# EAGLE design brushless_motorshield_v1 (EAGLE 6.5.0)
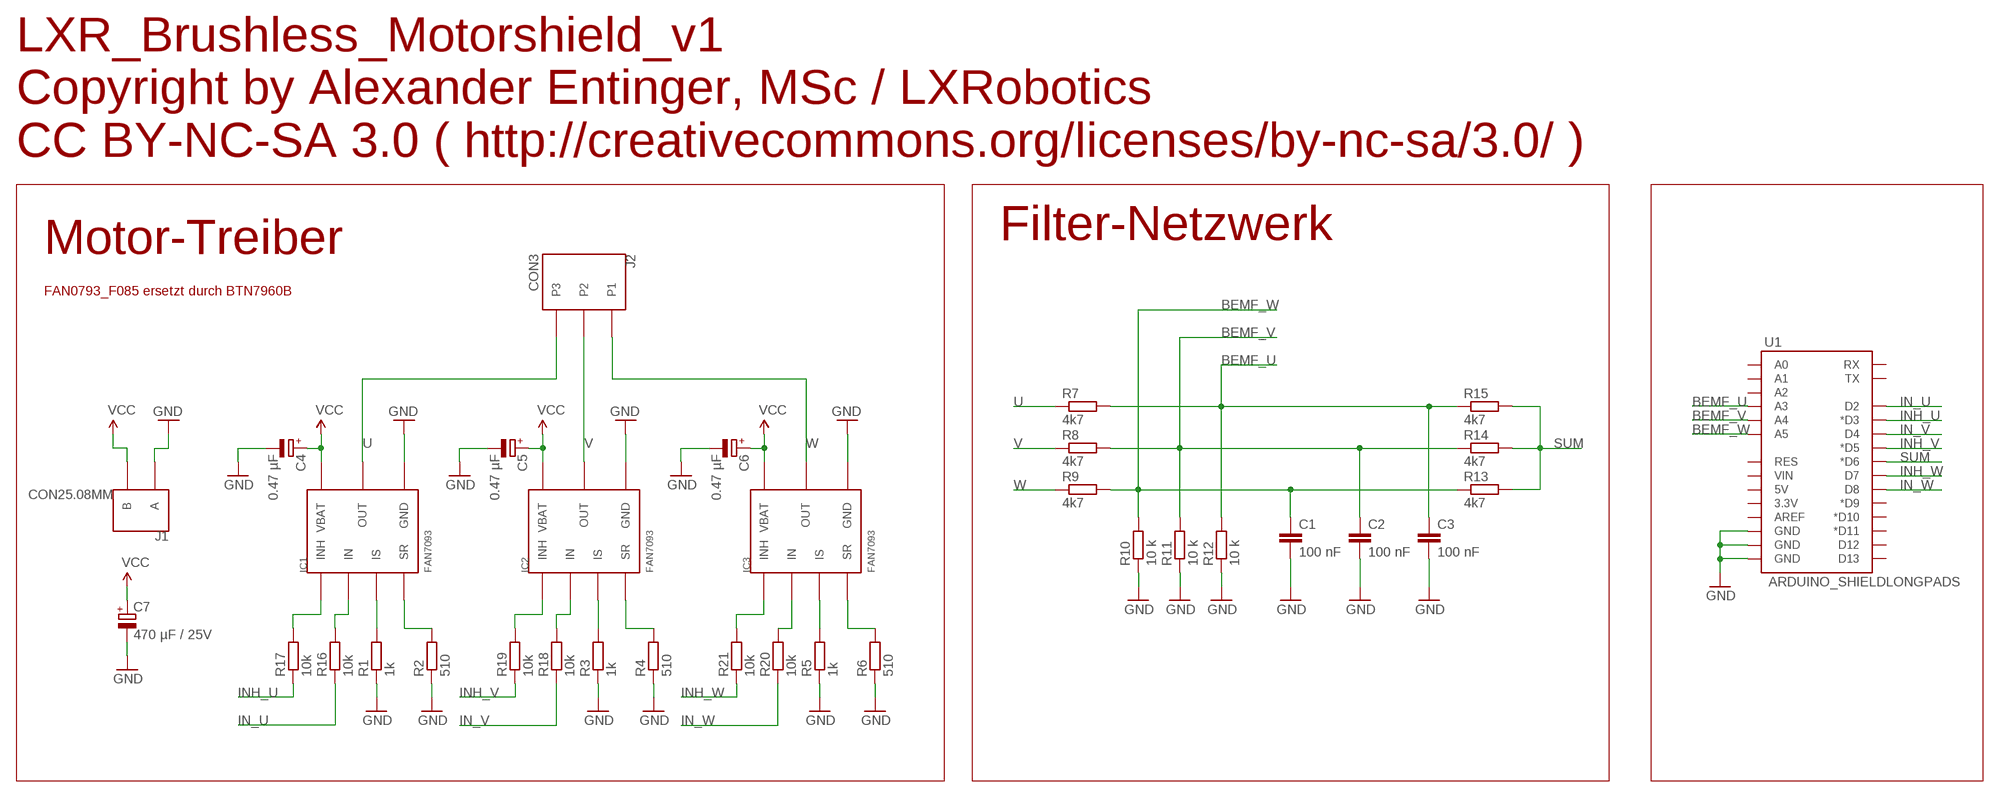
[diagram p0: schematic, sheet 1]

## Parts
C1  100 nF  C-EUC0805  [C0805]
C2  100 nF  C-EUC0805  [C0805]
C3  100 nF  C-EUC0805  [C0805]
C4  0.47 µF  CPOL-EU  [KEMET_A]
C5  0.47 µF  CPOL-EU  [KEMET_A]
C6  0.47 µF  CPOL-EU  [KEMET_A]
C7  470 µF / 25V  CPOL-EUE5-10.5  [E5-10,5]
IC1  FAN7093  [TO263-7L]
IC2  FAN7093  [TO263-7L]
IC3  FAN7093  [TO263-7L]
J1  CON25.08MM  [CON2_SCHRAUBKLEMME]
J2  CON3  [CON3_SCHRAUBKLEMME]
R1  1k  R-EU_R0805  [R0805]
R2  510  R-EU_R0805  [R0805]
R3  1k  R-EU_R0805  [R0805]
R4  510  R-EU_R0805  [R0805]
R5  1k  R-EU_R0805  [R0805]
R6  510  R-EU_R0805  [R0805]
R7  4k7  R-EU_R0805  [R0805]
R8  4k7  R-EU_R0805  [R0805]
R9  4k7  R-EU_R0805  [R0805]
R10  10 k  R-EU_R0805  [R0805]
R11  10 k  R-EU_R0805  [R0805]
R12  10 k  R-EU_R0805  [R0805]
R13  4k7  R-EU_R0805  [R0805]
R14  4k7  R-EU_R0805  [R0805]
R15  4k7  R-EU_R0805  [R0805]
R16  10k  R-EU_R0805  [R0805]
R17  10k  R-EU_R0805  [R0805]
R18  10k  R-EU_R0805  [R0805]
R19  10k  R-EU_R0805  [R0805]
R20  10k  R-EU_R0805  [R0805]
R21  10k  R-EU_R0805  [R0805]
U1  ARDUINO_SHIELDLONGPADS  [DUEMILANOVE_SHIELD_LONGPADS]

## Nets
BEMF_U: C3.1 R7.2 R12.2 R15.1 U1.A3
BEMF_V: C2.1 R8.2 R11.2 R14.1 U1.A4
BEMF_W: C1.1 R9.2 R10.2 R13.1 U1.A5
GND: C1.2 C2.2 C3.2 C4.CATHODE(-) C5.CATHODE(-) C6.CATHODE(-) C7.- IC1.GND IC2.GND IC3.GND J1.1(A) R1.1 R2.1 R3.1 R4.1 R5.1 R6.1 R10.1 R11.1 R12.1 U1.GND@0(GND) U1.GND@1(GND) U1.GND@2(GND)
IN_U: R16.1 U1.D2
IN_V: R18.1 U1.D4
IN_W: R20.1 U1.D8
INH_U: R17.1 U1.D3(*D3)
INH_V: R19.1 U1.D5(*D5)
INH_W: R21.1 U1.D7
N$1: IC1.IS R1.2
N$2: IC1.SR R2.2
N$3: IC2.IS R3.2
N$4: IC2.SR R4.2
N$5: IC3.IS R5.2
N$6: IC3.SR R6.2
N$7: IC1.INH R17.2
N$8: IC1.IN R16.2
N$9: IC3.INH R21.2
N$10: IC3.IN R20.2
N$17: IC2.INH R19.2
N$18: IC2.IN R18.2
SUM: R13.2 R14.2 R15.2 U1.D6(*D6)
U: IC1.OUT IC1.OUT@1(OUT) J2.P3 R7.1
V: IC2.OUT IC2.OUT@1(OUT) J2.P2 R8.1
VCC: C4.ANODE(+) C5.ANODE(+) C6.ANODE(+) C7.+ IC1.VBATT(VBAT) IC2.VBATT(VBAT) IC3.VBATT(VBAT) J1.2(B)
W: IC3.OUT IC3.OUT@1(OUT) J2.P1 R9.1
Unconnected: U1.3.3V U1.5V U1.A0 U1.A1 U1.A2 U1.AREF U1.D9(*D9) U1.D10(*D10) U1.D11(*D11) U1.D12 U1.D13 U1.RES U1.RX U1.TX U1.VIN

## Notes on the sheet
- LXR_Brushless_Motorshield_v1
  Copyright by Alexander Entinger, MSc / LXRobotics
  CC BY-NC-SA 3.0 ( http://creativecommons.org/licenses/by-nc-sa/3.0/ )
- Motor-Treiber | Filter-Netzwerk
- FAN0793_F085 ersetzt durch BTN7960B

## Library data of the parts
C1-C3 = resistor:C-EU: CAPACITOR, European symbol
C4-C7 = lxrobotics:CPOL-EU: POLARIZED CAPACITOR, European symbol
IC1-IC3 = lxrobotics:FAN7093
J1 = lxrobotics:CON2
J2 = lxrobotics:CON3
R1-R21 = resistor:R-EU_: RESISTOR, European symbol
U1 = SparkFun-Boards:ARDUINO_SHIELD: Arduino shield footprint

## Board
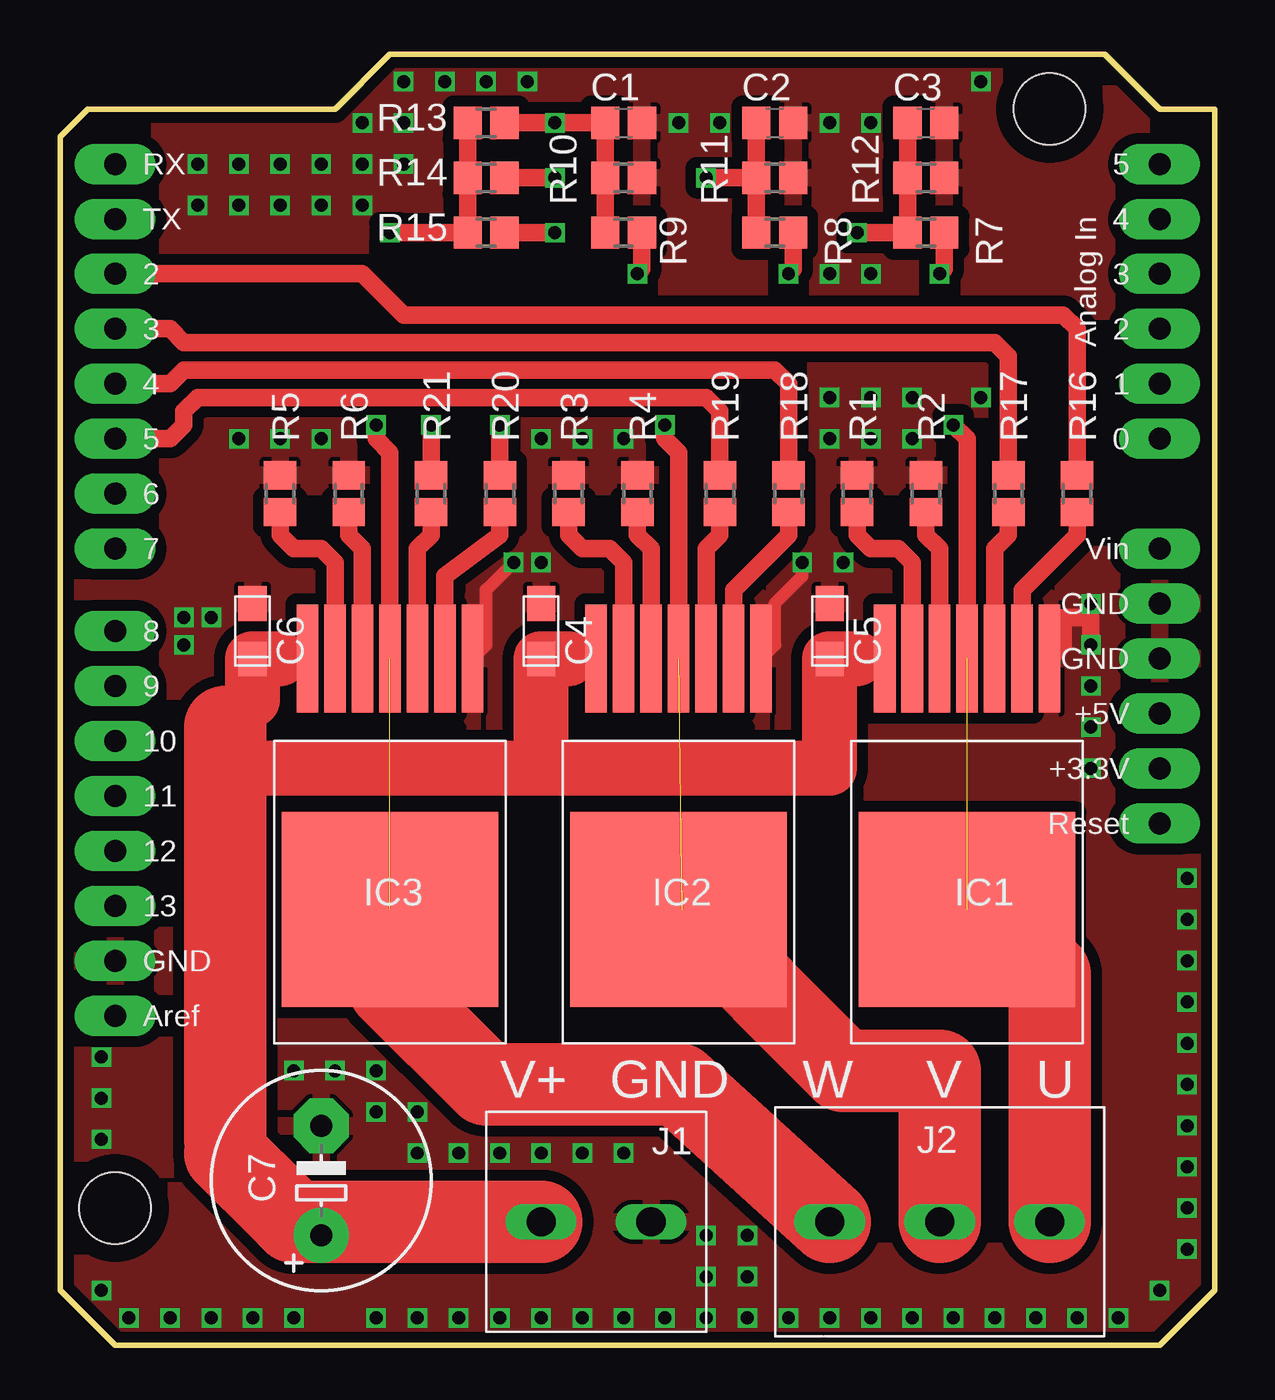
[diagram p1: board, top side]
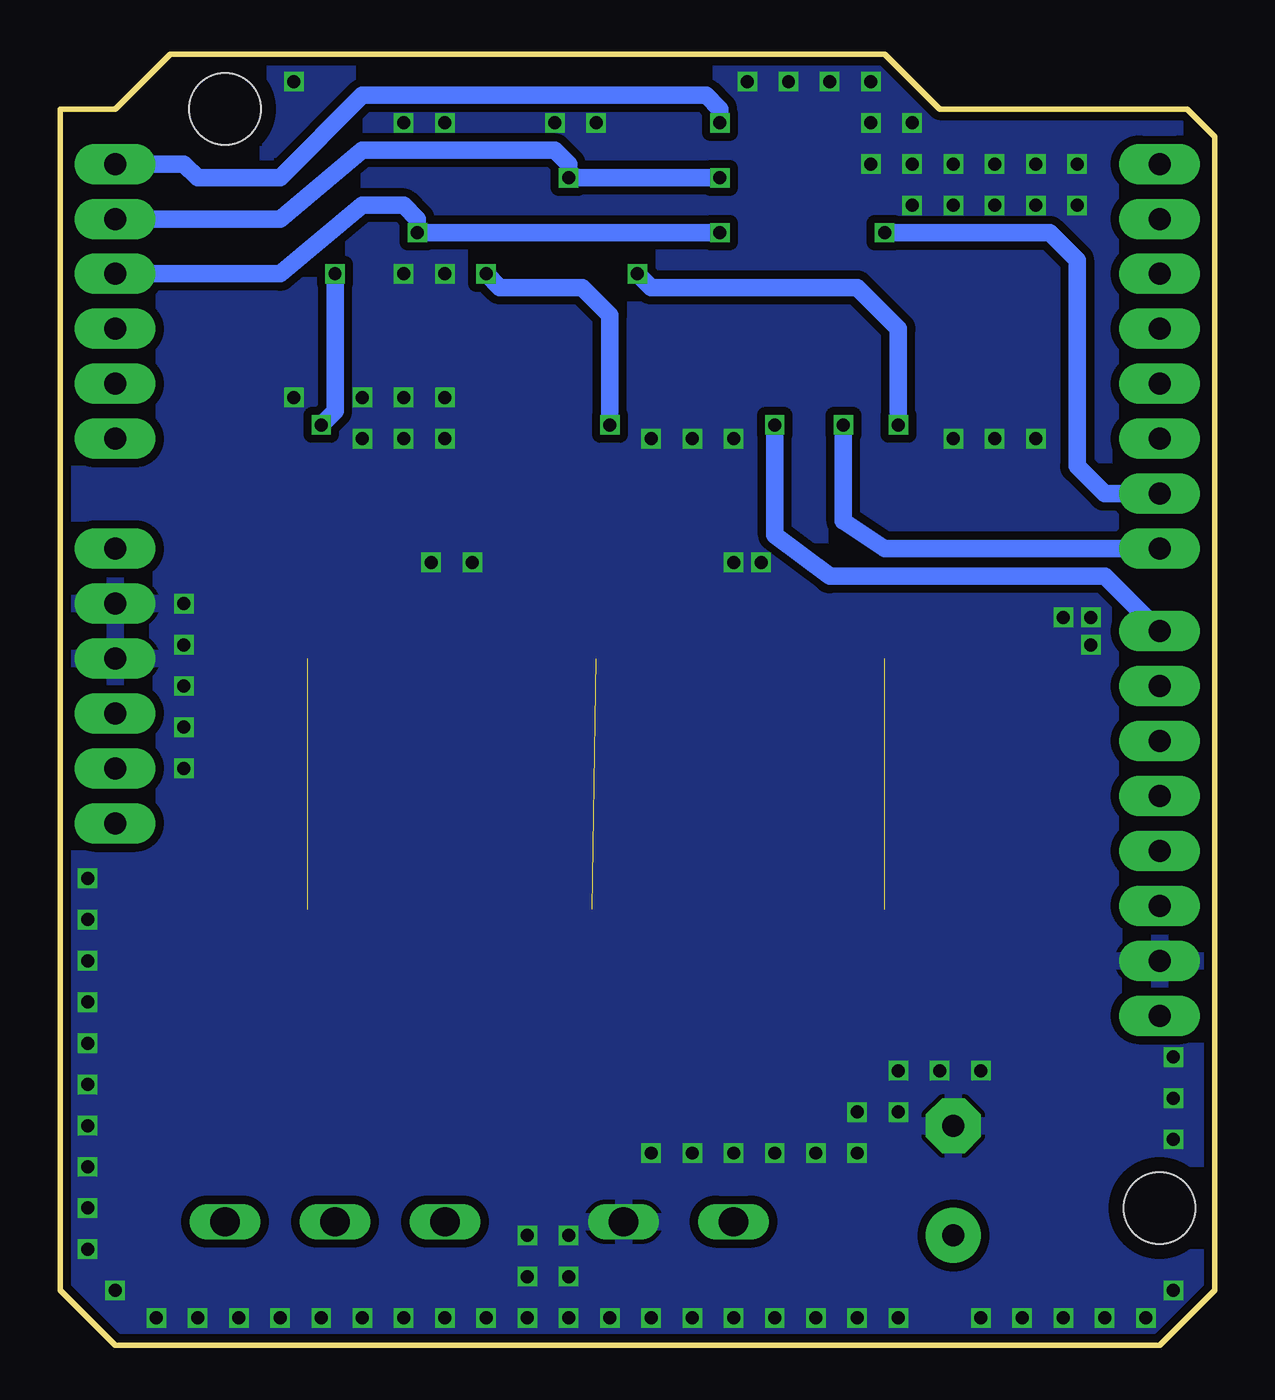
[diagram p2: board, bottom side, seen from below]

Size 53.34 x 59.69 mm. Coordinates in mm from the lower left corner, seen from the top.
Outline: 0,2.54 2.54,0 50.8,0 53.34,2.54 53.34,57.15 50.8,57.15 48.26,59.69 15.24,59.69 12.7,57.15 1.27,57.15 0,55.88 0,2.54
Copper layers (1*16): Top 0.035mm / dielectric 1.5mm / Bottom 0.035mm
Design rules "LeitOn - Standard-Eagle-DRU - 1- und  2-Lagen DK - deutsch - Rev 2.0": minimum track width 0.15mm, minimum drill 0.3mm, track to track 0.15mm, track to pad 0.15mm, pad to pad 0.15mm, via to via 0.15mm, smd to smd 0.15mm, copper to edge 0.3mm, drill to drill 0.3mm, minimum pad ring 0.15mm, minimum via ring 0.15mm, stop-mask expansion 0.075mm, vias tented up to drill 0mil, thermal gap 0.2mm

### Footprints (pad centres in the part's own frame; a part is rotated, then mirrored left to right if it is on the bottom)
C0805 = smd 1.3 x 1.5: 1 -0.85,0; 2 0.85,0
KEMET_A = smd 1.6 x 1.3: ANODE 1.275,0; CATHODE -1.275,0
E5-10,5 = drill 1.016 pad 2.54: + -2.54,0 | drill 1.016 pad 2.54 octagon: - 2.54,0
TO263-7L = smd 1 x 5: GND -3.81,0; IN -2.54,0; INH -1.27,0; IS 2.54,0; OUT 0,0; SR 1.27,0; VBATT 3.81,0 | smd 10 x 9: OUT@1 0,11.6
CON2_SCHRAUBKLEMME = drill 1.35 long: 1 -2.54,0; 2 2.54,0
CON3_SCHRAUBKLEMME = drill 1.35 long: P1 -5.08,0; P2 0,0; P3 5.08,0
R0805 = smd 1.3 x 1.5: 1 -0.85,0; 2 0.85,0
DUEMILANOVE_SHIELD_LONGPADS = drill 1.016 pad 1.88 long: 3.3V 50.8,26.67; 5V 50.8,29.21; A0 50.8,41.91; A1 50.8,44.45; A2 50.8,46.99; A3 50.8,49.53; A4 50.8,52.07; A5 50.8,54.61; AREF 2.54,15.24; D2 2.54,49.53; D3 2.54,46.99; D4 2.54,44.45; D5 2.54,41.91; D6 2.54,39.37; D7 2.54,36.83; D8 2.54,33.02; D9 2.54,30.48; D10 2.54,27.94; D11 2.54,25.4; D12 2.54,22.86; D13 2.54,20.32; GND@0 50.8,31.75; GND@1 50.8,34.29; GND@2 2.54,17.78; RES 50.8,24.13; RX 2.54,54.61; TX 2.54,52.07; VIN 50.8,36.83 | hole 3.302: 45.72,57.15; 2.54,6.35

### Placement (x,y rotation side)
C1  26.03,56.52 0 top
C2  33.02,56.52 0 top
C3  40,56.52 0 top
C4  22.23,33.02 270 top
C5  35.56,33.02 270 top
C6  8.89,33.02 270 top
C7  12.06,7.62 90 top
IC1  41.91,31.75 180 top
IC2  28.57,31.75 180 top
IC3  15.24,31.75 180 top
J1  24.77,5.71 180 top
J2  40.64,5.71 0 top
R1  36.83,39.37 270 top
R2  40,39.37 270 top
R3  23.49,39.37 270 top
R4  26.67,39.37 270 top
R5  10.16,39.37 270 top
R6  13.33,39.37 270 top
R7  40,51.44 180 top
R8  33.02,51.44 180 top
R9  26.03,51.44 180 top
R10  26.03,53.97 180 top
R11  33.02,53.97 180 top
R12  40,53.97 180 top
R13  19.69,56.52 180 top
R14  19.69,53.97 180 top
R15  19.69,51.44 180 top
R16  46.99,39.37 270 top
R17  43.81,39.37 270 top
R18  33.66,39.37 270 top
R19  30.48,39.37 270 top
R20  20.32,39.37 270 top
R21  17.14,39.37 270 top
U1  0,0 0 top

### Tracks (layer width: path | path; a pad name or v marks a point on that pad's centre or on a via)
BEMF_U  (via drill 0.6)
  Top 0.813: C3.1 R12.2 R7.2 v36.83,51.44 | R15.1 v22.86,51.44
  Bottom 0.813: U1.A3 43.18,49.53 39.37,52.7 37.46,52.7 36.83,52.07 v36.83,51.44 v22.86,51.44
BEMF_V  (via drill 0.6)
  Top 0.813: C2.1 32.38,56.52 32.17,56.3 R11.2 | R11.2 R8.2 | R11.2 v29.84,53.97 | R14.1 v22.86,53.97
  Bottom 0.813: U1.A4 43.18,52.07 39.37,55.25 30.48,55.25 29.84,54.61 v29.84,53.97 v22.86,53.97
BEMF_W  (via drill 0.6)
  Top 0.813: R9.2 R10.2 C1.1 v22.86,56.52 R13.1
  Bottom 0.813: v22.86,56.52 22.86,57.15 23.49,57.78 39.37,57.78 43.18,53.97 46.99,53.97 47.62,54.61 U1.A5
GND  (via drill 0.6)
  Top 0.61: IC3.GND 19.69,32.38 19.69,34.92 v20.95,36.2 | IC2.GND 33.02,32.38 33.02,34.29 34.29,35.56 v34.29,36.2
  Top 0.813: C1.2 26.67,56.52 | IC1.GND 46.36,32.38 46.36,33.66 47.62,33.66 v47.62,32.38
  other vias: 3.17,1.27 5.08,1.27 6.98,1.27 8.89,1.27 10.79,1.27 14.6,1.27 16.51,1.27 18.41,1.27 20.32,1.27 22.23,1.27 24.13,1.27 26.03,1.27 27.94,1.27 29.84,1.27 31.75,1.27 33.66,1.27 35.56,1.27 37.46,1.27 39.37,1.27 41.27,1.27 43.18,1.27 45.09,1.27 46.99,1.27 48.89,1.27 1.9,13.33 1.9,11.43 1.9,9.52 1.9,2.54 50.8,2.54 52.07,4.45 52.07,6.35 52.07,8.25 52.07,10.16 52.07,12.06 52.07,13.97 52.07,15.88 52.07,17.78 52.07,19.69 52.07,21.59 15.88,58.42 17.78,58.42 19.69,58.42 21.59,58.42 28.57,56.52 30.48,56.52 35.56,56.52 37.46,56.52 42.55,58.42 35.56,49.53 37.46,49.53 8.25,41.91 10.16,41.91 12.06,41.91 22.23,41.91 24.13,41.91 26.03,41.91 35.56,43.81 35.56,41.91 37.46,41.91 39.37,43.81 37.46,43.81 39.37,41.91 42.55,43.81 5.71,32.38 5.71,33.66 6.98,33.66 22.23,36.2 36.2,36.2 13.97,56.52 15.88,56.52 15.88,54.61 13.97,54.61 13.97,52.7 12.06,52.7 12.06,54.61 10.16,54.61 10.16,52.7 8.25,52.7 8.25,54.61 6.35,54.61 6.35,52.7 10.79,12.7 12.7,12.7 14.6,12.7 14.6,10.79 16.51,10.79 16.51,8.89 18.41,8.89 20.32,8.89 22.23,8.89 24.13,8.89 26.03,8.89 29.84,5.08 31.75,5.08 31.75,3.17 29.84,3.17 47.62,34.29 47.62,30.48 47.62,28.57 47.62,26.67
  pour Bottom (isolate 0.381): 50.16,0.63 2.54,0.63 0.63,2.54 0.63,55.88 1.27,56.52 12.7,56.52 15.24,59.05 47.62,59.05 50.16,56.52 52.7,56.52 52.7,3.17
  pour Top (isolate 0.508): 0.63,2.54 2.54,0.63 50.16,0.63 52.7,3.17 52.7,56.52 50.8,56.52 48.26,59.05 15.24,59.05 12.7,56.52 1.27,56.52 0.63,55.88
IN_U
  Top 0.813: R16.1 46.99,46.99 46.36,47.62 15.88,47.62 13.97,49.53 U1.D2
IN_V
  Top 0.813: U1.D4 5.08,44.45 5.71,45.09 33.02,45.09 33.66,44.45 R18.1
IN_W  (via drill 0.6)
  Top 0.813: v20.32,42.55 R20.1
  Bottom 0.813: U1.D8 5.08,35.56 17.78,35.56 20.32,37.46 v20.32,42.55
INH_U
  Top 0.813: U1.D3 5.08,46.99 5.71,46.36 43.18,46.36 43.81,45.72 R17.1
INH_V
  Top 0.813: U1.D5 5.08,41.91 5.71,42.55 5.71,43.18 6.35,43.81 29.84,43.81 30.48,43.18 R19.1
INH_W  (via drill 0.6)
  Top 0.813: v17.14,42.55 R21.1
  Bottom 0.813: U1.D7 15.24,36.83 17.14,38.1 v17.14,42.55
N$1
  Top 0.813: IC1.IS 39.37,36.2 38.73,36.83 37.46,36.83 36.83,37.46 R1.2
N$2
  Top 0.813: IC1.SR 40.64,36.83 40,37.46 R2.2
N$3
  Top 0.813: R3.2 23.49,37.46 24.13,36.83 25.4,36.83 26.03,36.2 IC2.IS
N$4
  Top 0.813: IC2.SR 27.3,36.83 26.67,37.46 R4.2
N$5
  Top 0.813: IC3.IS 12.7,36.2 12.06,36.83 10.79,36.83 10.16,37.46 R5.2
N$6
  Top 0.813: IC3.SR 13.97,36.83 13.33,37.46 R6.2
N$7
  Top 0.813: IC1.INH 43.18,36.83 43.81,37.46 R17.2
N$8
  Top 0.813: IC1.IN 44.45,34.92 46.99,37.46 R16.2
N$9
  Top 0.813: IC3.INH 16.51,36.83 17.14,37.46 R21.2
N$10
  Top 0.813: IC3.IN 17.78,35.56 20.32,37.46 R20.2
N$17
  Top 0.813: IC2.INH 29.84,36.83 30.48,37.46 R19.2
N$18
  Top 0.813: IC2.IN 31.12,34.92 33.66,37.46 R18.2
SUM  (via drill 0.6)
  Top 0.813: v15.24,51.44 R15.2 R14.2 R13.2
  Bottom 0.813: v15.24,51.44 7.62,51.44 6.35,50.16 6.35,40.64 5.08,39.37 U1.D6
U  (via drill 0.6)  (1 unrouted)
  Top 0.813: IC1.OUT 41.91,41.91 v41.27,42.55 | v40.64,49.53 40.85,49.75 R7.1
  Top 3.81: J2.P3 45.72,17.14 42.71,20.15 IC1.OUT@1
  Bottom 0.813: v41.27,42.55 40.64,43.18 v40.64,49.53
V  (via drill 0.6)  (1 unrouted)
  Top 0.813: IC2.OUT 28.57,41.27 27.94,41.91 v27.94,42.55 | v33.66,49.53 33.87,49.75 R8.1
  Top 3.81: J2.P2 40.64,12.7 36.2,12.7 28.74,20.15 IC2.OUT@1
  Bottom 0.813: v27.94,42.55 27.94,47.62 29.21,48.89 33.02,48.89 v33.66,49.53
VCC
  Top 0.61: 23.49,31.75 IC2.VBATT | 36.83,31.75 IC1.VBATT | 10.16,31.75 IC3.VBATT
  Top 0.813: C6.ANODE
  Top 1.016: 7.62,28.57 8.89,29.84
  Top 1.27: 11.43,5.08 10.79,5.71 10.79,6.98 10.16,6.35 10.16,5.08 C7.+ | 7.62,8.89 7.62,10.79
  Top 2.54: 22.23,26.67 35.56,26.67 C5.ANODE 36.83,31.75 | 22.23,26.67 7.62,26.67 | 22.23,26.67 C4.ANODE 23.49,31.75 | 8.89,29.84 C6.ANODE | C6.ANODE 10.16,31.75
  Top 3.81: 7.62,9.52 7.62,10.79 7.62,26.67 7.62,28.57 | J1.2 10.79,5.71 10.16,6.35 7.62,8.89
W  (via drill 0.6)  (1 unrouted)
  Top 0.813: IC3.OUT 15.24,41.27 14.6,41.91 v14.6,42.55 | v26.67,49.53 26.88,49.75 R9.1
  Top 3.81: J2.P1 28.57,12.06 19.69,12.06 15.24,16.51 IC3.OUT@1
  Bottom 0.813: v14.6,42.55 14.6,46.99 16.51,48.89 26.03,48.89 v26.67,49.53

### Text on the board
tNames: V+ | GND | W | V | U